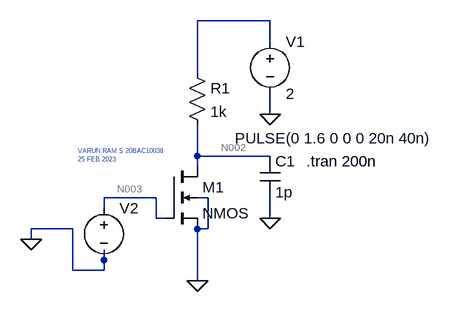
[diagram p0: schematic EXP4.asc]
EXP4.asc, the LTspice schematic file:
Version 4
SHEET 1 880 680
WIRE 336 -128 224 -128
WIRE 336 -96 336 -128
WIRE 224 -48 224 -128
WIRE 336 16 336 -16
WIRE 224 80 224 32
WIRE 336 80 224 80
WIRE 224 96 224 80
WIRE 160 144 80 144
WIRE 240 144 224 144
WIRE 80 160 80 144
WIRE 160 176 160 144
WIRE 176 176 160 176
WIRE 336 176 336 144
WIRE 32 192 -32 192
WIRE 240 192 240 144
WIRE 240 192 224 192
WIRE -32 208 -32 192
WIRE 80 240 80 224
WIRE 32 256 32 192
WIRE 80 256 80 240
WIRE 80 256 32 256
WIRE 224 272 224 192
FLAG -32 208 0
FLAG 224 272 0
FLAG 336 176 0
FLAG 336 16 0
SYMBOL nmos4 176 96 R0
SYMATTR InstName M1
SYMBOL res 208 -64 R0
SYMATTR InstName R1
SYMATTR Value 1k
SYMBOL cap 320 80 R0
SYMATTR InstName C1
SYMATTR Value 1p
SYMBOL voltage 336 -112 R0
WINDOW 123 0 0 Left 0
WINDOW 39 0 0 Left 0
SYMATTR InstName V1
SYMATTR Value 2
SYMBOL voltage 80 144 R0
WINDOW 123 0 0 Left 0
WINDOW 39 0 0 Left 0
WINDOW 3 202 -91 Left 2
SYMATTR InstName V2
SYMATTR Value PULSE(0 1.6 0 0 0 20n 40n)
TEXT 392 88 Left 2 !.tran 200n
TEXT 40 72 Left 0 ;VARUN RAM S 20BAC10038\n25 FEB 2023

The netlist it stands for:
* EXP4.asc
M1 N002 N003 0 0 NMOS
R1 N001 N002 1k
C1 N002 0 1p
V1 N001 0 2
V2 N003 0 PULSE(0 1.6 0 0 0 20n 40n)
.model NMOS NMOS
.model PMOS PMOS
.lib standard.mos
.tran 200n
* VARUN RAM S 20BAC10038
* 25 FEB 2023
.backanno
.end

* Results of the author's LTspice run, read from the files saved beside the schematic
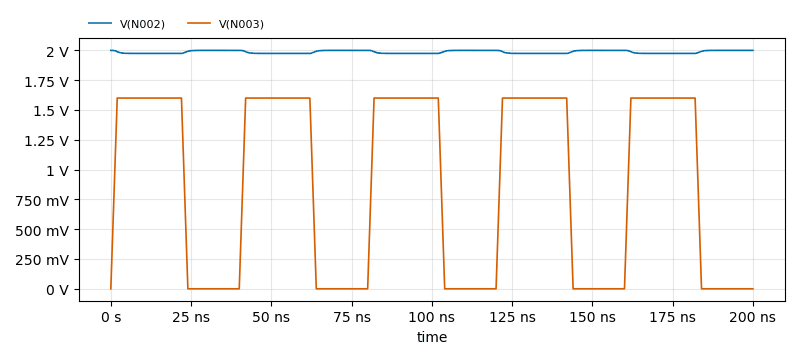
[diagram p1: Transient Analysis of EXP4.asc, plotted from the saved traces]
* Transient Analysis, 1 run:
*   V(N002): min 1.974 V, max 2 V, average 1.986 V, rms 1.986 V, last 2 V
*   V(N003): min 0 V, max 1.6 V, average 880 mV, rms 1.169 V, last 0 V